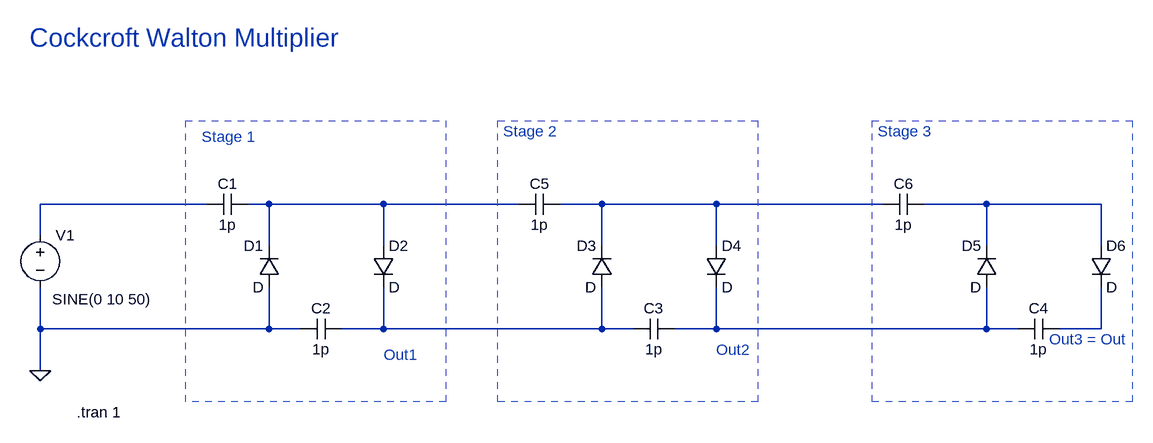
[diagram p0: schematic Cockcroft-walton-multiplier.asc]
Cockcroft-walton-multiplier.asc, the LTspice schematic file:
Version 4.1
SHEET 1 1540 680
WIRE 112 48 -144 48
WIRE 208 48 176 48
WIRE 384 48 208 48
WIRE 592 48 384 48
WIRE 720 48 656 48
WIRE 896 48 720 48
WIRE 1152 48 896 48
WIRE 1312 48 1216 48
WIRE 1488 48 1312 48
WIRE -144 96 -144 48
WIRE 208 112 208 48
WIRE 384 112 384 48
WIRE 720 112 720 48
WIRE 896 112 896 48
WIRE 1312 112 1312 48
WIRE 1488 112 1488 48
WIRE -144 240 -144 176
WIRE 208 240 208 176
WIRE 208 240 -144 240
WIRE 256 240 208 240
WIRE 384 240 384 176
WIRE 384 240 320 240
WIRE 720 240 720 176
WIRE 720 240 384 240
WIRE 768 240 720 240
WIRE 896 240 896 176
WIRE 896 240 832 240
WIRE 1312 240 1312 176
WIRE 1312 240 896 240
WIRE 1360 240 1312 240
WIRE 1488 240 1488 176
WIRE 1488 240 1424 240
WIRE -144 304 -144 240
FLAG -144 304 0
SYMBOL voltage -144 80 R0
WINDOW 3 18 114 Left 2
WINDOW 123 24 124 Left 2
WINDOW 39 0 0 Left 2
SYMATTR Value SINE(0 10 50)
SYMATTR InstName V1
SYMBOL diode 224 176 R180
WINDOW 0 24 64 Left 2
WINDOW 3 24 0 Left 2
SYMATTR InstName D1
SYMBOL diode 368 112 R0
SYMATTR InstName D2
SYMBOL cap 112 64 R270
WINDOW 0 32 32 VTop 2
WINDOW 3 0 32 VBottom 2
SYMATTR InstName C1
SYMATTR Value 1p
SYMBOL cap 256 256 R270
WINDOW 0 32 32 VTop 2
WINDOW 3 0 32 VBottom 2
SYMATTR InstName C2
SYMATTR Value 1p
SYMBOL diode 736 176 R180
WINDOW 0 24 64 Left 2
WINDOW 3 24 0 Left 2
SYMATTR InstName D3
SYMBOL diode 880 112 R0
SYMATTR InstName D4
SYMBOL cap 768 256 R270
WINDOW 0 32 32 VTop 2
WINDOW 3 0 32 VBottom 2
SYMATTR InstName C3
SYMATTR Value 1p
SYMBOL diode 1328 176 R180
WINDOW 0 24 64 Left 2
WINDOW 3 24 0 Left 2
SYMATTR InstName D5
SYMBOL diode 1472 112 R0
SYMATTR InstName D6
SYMBOL cap 1360 256 R270
WINDOW 0 32 32 VTop 2
WINDOW 3 0 32 VBottom 2
SYMATTR InstName C4
SYMATTR Value 1p
SYMBOL cap 592 64 R270
WINDOW 0 32 32 VTop 2
WINDOW 3 0 32 VBottom 2
SYMATTR InstName C5
SYMATTR Value 1p
SYMBOL cap 1152 64 R270
WINDOW 0 32 32 VTop 2
WINDOW 3 0 32 VBottom 2
SYMATTR InstName C6
SYMATTR Value 1p
TEXT -88 368 Left 2 !.tran 1
TEXT 104 -56 Left 2 ;Stage 1
TEXT 568 -64 Left 2 ;Stage 2
TEXT 1144 -64 Left 2 ;Stage 3
TEXT 384 280 Left 2 ;Out1
TEXT 896 272 Left 2 ;Out2
TEXT 1408 256 Left 2 ;Out3 = Out
TEXT -160 -208 Left 4 ;Cockcroft Walton Multiplier
RECTANGLE Normal 480 352 80 -80 2
RECTANGLE Normal 960 352 560 -80 2
RECTANGLE Normal 1536 352 1136 -80 2

The netlist it stands for:
* Cockcroft-walton-multiplier.asc
V1 N001 0 SINE(0 10 50)
D1 0 N002 D
D2 N002 N005 D
C1 N001 N002 1p
C2 0 N005 1p
D3 N005 N003 D
D4 N003 N006 D
C3 N005 N006 1p
D5 N006 N004 D
D6 N004 N007 D
C4 N006 N007 1p
C5 N002 N003 1p
C6 N003 N004 1p
.model D D
.lib standard.dio
.tran 1
* Stage 1
* Stage 2
* Stage 3
* Out1
* Out2
* Out3 = Out
* Cockcroft Walton Multiplier
.backanno
.end